# EAGLE board Arduino_DUE_V02b (EAGLE 6.4), part 1 of 2
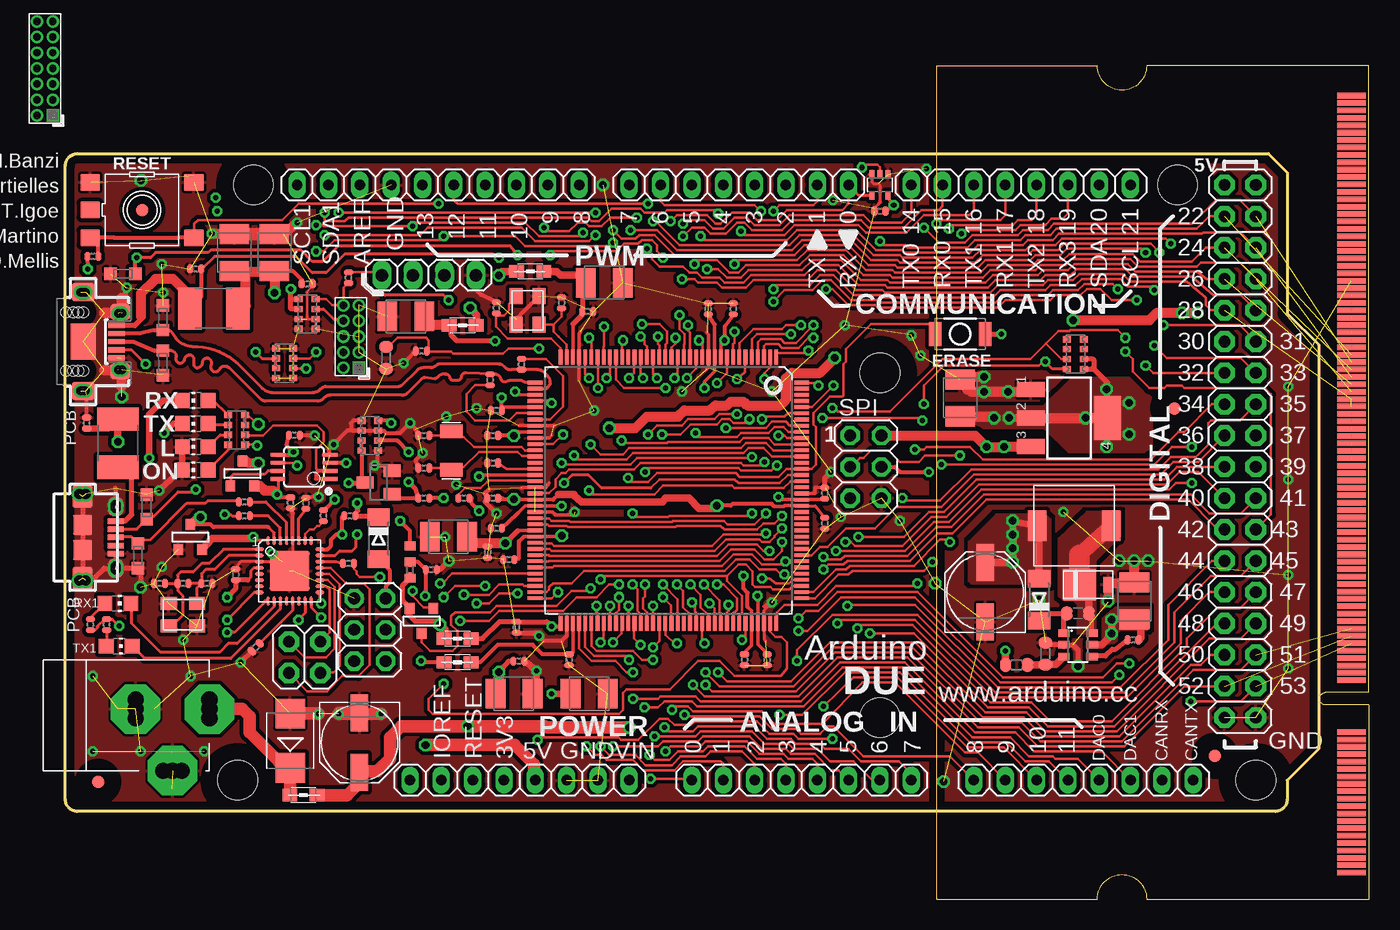
[diagram p3: board, top side]
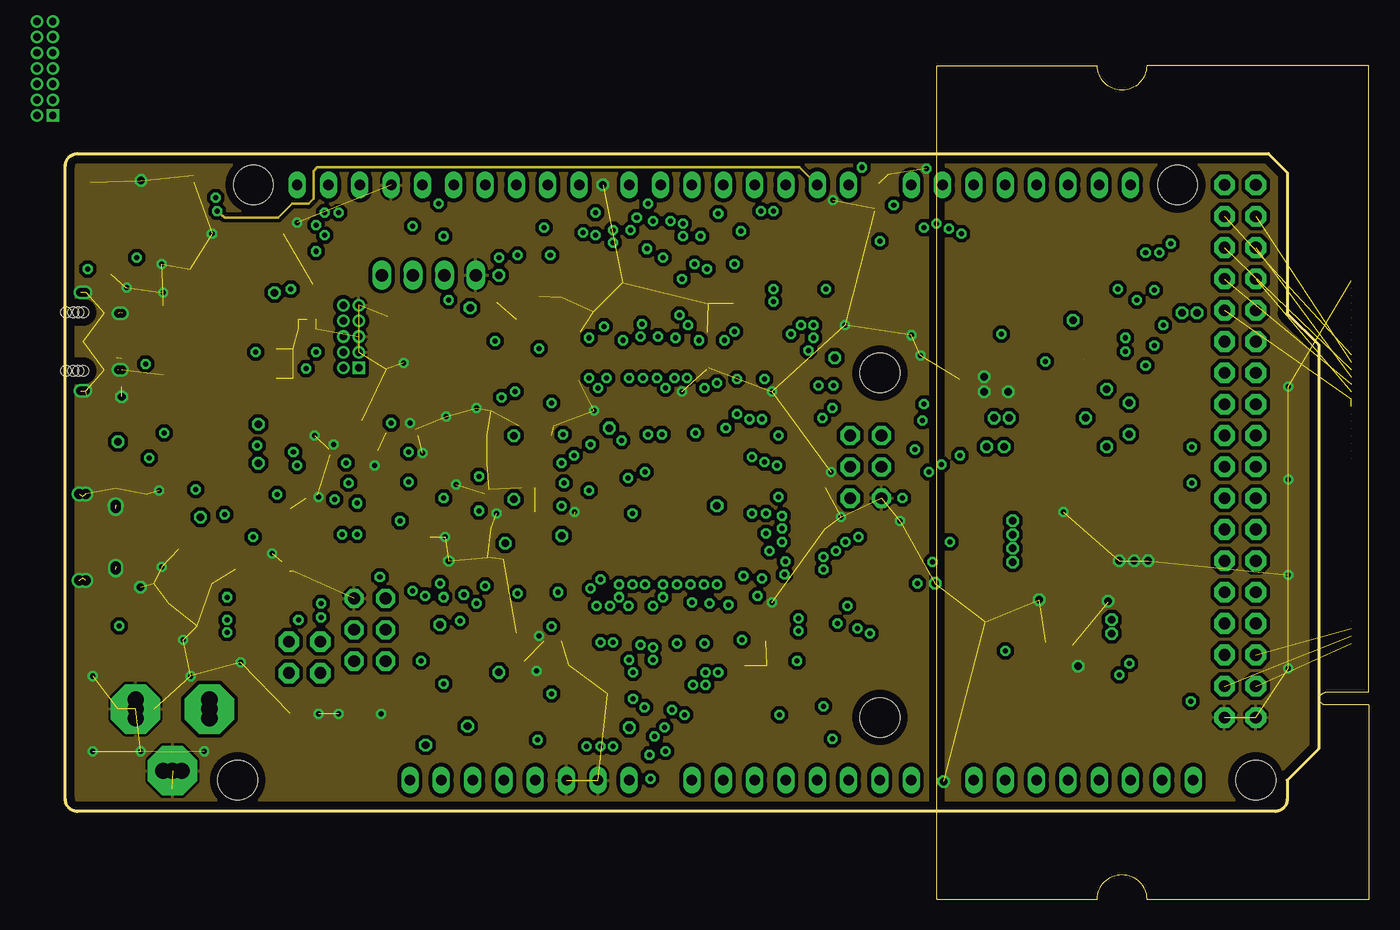
[diagram p4: board, inner layer Route2]
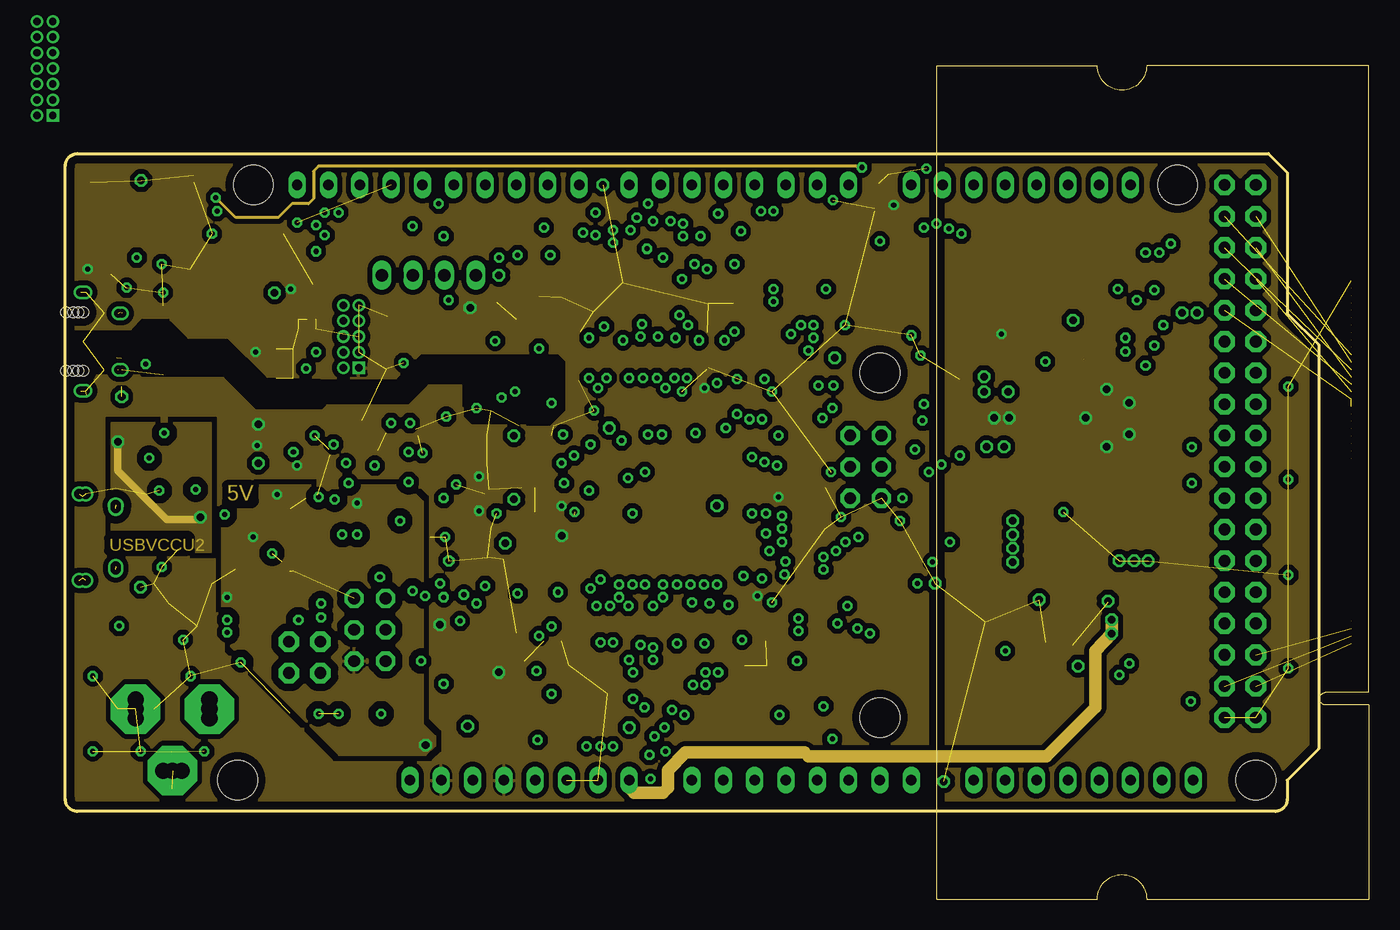
[diagram p5: board, inner layer Route15]
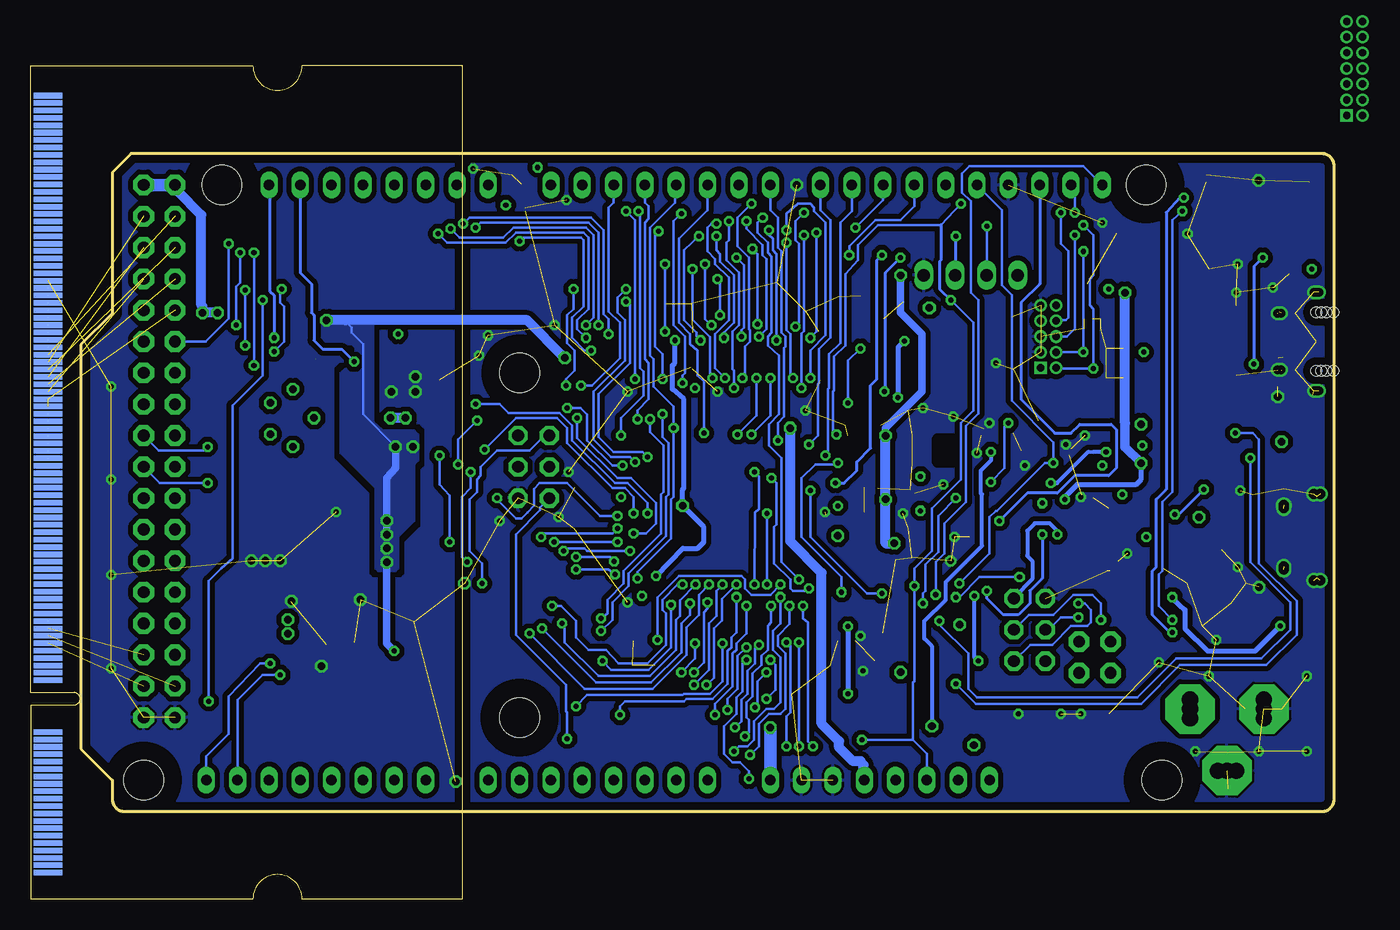
[diagram p6: board, bottom side, seen from below]

Size 101.6 x 53.34 mm. Coordinates in mm from the lower left corner, seen from the top.
Outline: 97.54,53.34 99.06,51.82 99.06,40.39 101.6,37.85 101.6,5.08 99.06,2.54 99.06,1 arc-90 98.06,0 1,0 arc-90 0,1 0,52.34 arc-90 1,53.34 97.54,53.34
Copper layers (1*2*15*16): Top 0.035mm / dielectric 0.2mm / Route2 0.035mm / dielectric 1mm / Route15 0.035mm / dielectric 0.2mm / Bottom 0.035mm
Design rules "default": minimum track width 8mil, minimum drill 16mil, track to track 8mil, track to pad 8mil, pad to pad 6mil, via to via 8mil, smd to smd 6mil, copper to edge 25mil, drill to drill 12mil, minimum pad ring 8mil, minimum via ring 8mil, stop-mask expansion 2mil, vias tented up to drill 25mil, thermal gap 8mil
Net classes: 0 default: width 0.203 mm, drill 0.305 mm, clearance 0.203 mm; 1 USB: drill 0.406 mm, clearance 0.203 mm to class 0, clearance 0.406 mm; 2 gnd: width 0.305 mm, drill 0.406 mm, clearance 0.203 mm to class 0, clearance 0.203 mm; 3 usbvcc: width 0.61 mm, drill 0.508 mm, clearance 0.203 mm to class 0, clearance 0.254 mm
Holes 3.2 mm at 96.52,2.54 15.24,50.8 90.17,50.8 13.97,2.54 66.04,35.56 66.04,7.62
tRestrict: area 63.5,5.1 to 68.6,10.2; area 12.7,48.3 to 17.8,53.3; area 63.5,33 to 68.6,38.1; area 87.6,48.3 to 92.7,53.3; area 94,0 to 99.1,5.1; area 11.4,0 to 16.5,5.1
bRestrict: area 63.5,5.1 to 68.6,10.2; area 12.7,48.3 to 17.8,53.3; area 63.5,33 to 68.6,38.1; area 87.6,48.3 to 92.7,53.3; area 94,0 to 99.1,5.1; area 11.4,0 to 16.5,5.1

## Footprints (pad centres in the part's own frame; a part is rotated, then mirrored left to right if it is on the bottom)
1X08 = drill 0.85 pad 1.422 long: 1 -8.89,0; 2 -6.35,0; 3 -3.81,0; 4 -1.27,0; 5 1.27,0; 6 3.81,0; 7 6.35,0; 8 8.89,0
J0402 = smd 0.7 x 0.9: 1 -0.65,0; 2 0.65,0; 3 1.95,0
SMC_B = smd 1.6 x 2.4: + -1.5,0; - 1.5,0
C0402 = smd 0.508 x 0.762: 1 -0.445,0; 2 0.445,0
C0603-ROUND = smd 0.898 x 1.1: 1 -0.889,0; 2 0.889,0
SMB = smd 2.4 x 2.4: A 2.2,0; C -2.2,0
MINIMELF = smd 1.4 x 1.8: A 1.7,0; C -1.7,0
DO220AAL = smd 2.667 x 2.54: P$1 -0.7,0 | smd 0.762 x 1.27: P$2 1.65,0
1X04 = drill 1.016 long: 1 -3.81,0; 2 -1.27,0; 3 1.27,0; 4 3.81,0
SMD_157SW = smd 1.016 x 1.981: 1 -2.032,0; 2 2.032,0
L1812 = smd 1.9 x 3.4: 1 -1.95,0; 2 1.95,0
FIDUCIA-MOUNT = smd 1.016 x 1.016: P$1 0,0
MSOP08 = smd 0.3 x 1.2: 1 -0.976,-2.113; 2 -0.326,-2.113; 3 0.324,-2.113; 4 0.974,-2.113; 5 0.974,2.112; 6 0.324,2.112; 7 -0.326,2.112; 8 -0.976,2.112
SOT23-6 = smd 0.6 x 0.9: 1 -0.95,-1.15; 2 0,-1.15; 3 0.95,-1.15; 4 0.95,1.15; 5 0,1.15; 6 -0.95,1.15
SOT223 = smd 1.219 x 2.235: 1 -2.311,-3.099; 2 0,-3.099; 3 2.311,-3.099 | smd 3.6 x 2.2: 4 0,3.099
MLF32 = smd 0.7 x 0.28: 1 -2.45,1.75; 2 -2.45,1.25; 3 -2.45,0.75; 4 -2.45,0.25; 5 -2.45,-0.25; 6 -2.45,-0.75; 7 -2.45,-1.25; 8 -2.45,-1.75; 17 2.45,-1.75; 18 2.45,-1.25; 19 2.45,-0.75; 20 2.45,-0.25; 21 2.45,0.25; 22 2.45,0.75; 23 2.45,1.25; 24 2.45,1.75 | smd 0.28 x 0.7: 9 -1.75,-2.45; 10 -1.25,-2.45; 11 -0.75,-2.45; 12 -0.25,-2.45; 13 0.25,-2.45; 14 0.75,-2.45; 15 1.25,-2.45; 16 1.75,-2.45; 25 1.75,2.45; 26 1.25,2.45; 27 0.75,2.45; 28 0.25,2.45; 29 -0.25,2.45; 30 -0.75,2.45; 31 -1.25,2.45; 32 -1.75,2.45 | smd 3.254 x 3.254: 33 0,0
SC70-5 = smd 0.4 x 0.7: 1 -0.65,-0.85; 2 0,-0.85; 3 0.65,-0.85; 4 0.65,0.85; 5 -0.65,0.85
2X03 = drill 0.95 pad 1.55 octagon: 1 -2.54,-1.27; 2 -2.54,1.27; 3 0,-1.27; 4 0,1.27; 5 2.54,-1.27; 6 2.54,1.27
CON2_USB_MICRO_B_AT = smd 0.406 x 1.346: P1 -1.321,2.692; P2 -0.66,2.692; P3 0,2.692; P4 0.66,2.692; P5 1.321,2.692 | drill 0.8 pad 1.27: P$1 -2.616,2.692 | drill 0.8 pad 1.245: P$2 -2.362,2.692; P$7 2.362,2.692; P$8 2.616,2.692 | drill 0.8 pad 1.143: P$3 -3.505,-0.254; P$4 -3.505,0.254; P$5 3.505,0.254; P$6 3.505,-0.254 | smd 1.778 x 1.651: S1 -3.302,0; S2 3.302,0 | smd 1.524 x 1.27: S3 -2.489,2.692; S4 2.489,2.692 | smd 1.626 x 1.524: S5 -1.016,0; S6 1.016,0
2X02 = drill 0.95 pad 1.676 octagon: 1 -1.27,-1.27; 2 -1.27,1.27; 3 1.27,-1.27; 4 1.27,1.27
R0402 = smd 0.508 x 0.762: 1 -0.445,0; 2 0.445,0
PINHEAD_2X05_127 = drill 0.6 pad 1.016 square: 1 -0.635,2.54 | drill 0.6 pad 1.016: 2 0.635,2.54; 3 -0.635,1.27; 4 0.635,1.27; 5 -0.635,0; 6 0.635,0; 7 -0.635,-1.27; 8 0.635,-1.27; 9 -0.635,-2.54; 10 0.635,-2.54
CHIP-LED0805 = smd 1.2 x 1.2: A 0,-1.05; C 0,1.05
0805 = smd 1.2 x 1: 1 -1.1,0; 2 1.1,0
SRR0604 = smd 1.5 x 2.5: P$1 3,0; P$2 -3,0
PINHEAD_2X07_127 = drill 0.6 pad 1.016 square: 1 -0.635,3.81 | drill 0.6 pad 1.016: 2 0.635,3.81; 3 -0.635,2.54; 4 0.635,2.54; 5 -0.635,1.27; 6 0.635,1.27; 7 -0.635,0; 8 0.635,0; 9 -0.635,-1.27; 10 0.635,-1.27; 11 -0.635,-2.54; 12 0.635,-2.54; 13 -0.635,-3.81; 14 0.635,-3.81
PANASONIC_D = smd 3 x 1.4: + 2.4,0; - -2.4,0
1X10 = drill 0.85 pad 1.422 long: 1 -11.43,0; 2 -8.89,0; 3 -6.35,0; 4 -3.81,0; 5 -1.27,0; 6 1.27,0; 7 3.81,0; 8 6.35,0; 9 8.89,0; 10 11.43,0
SOT23 = smd 1 x 1.4: 1 -0.95,-1.1; 2 0.95,-1.1; 3 0,1.1
R0603-ROUND = smd 0.898 x 1.1: 1 -0.889,0; 2 0.889,0
TS42 = smd 1.6 x 1.4: 1 -4.2,2.25; 2 4.2,2.25; 3 -4.2,-2.25; 4 4.2,-2.25; 5 -4.2,0
CAT16 = smd 0.5 x 0.65: 1 -1.2,-0.675; 2 -0.4,-0.675; 3 0.4,-0.675; 4 1.2,-0.675; 5 1.2,0.675; 6 0.4,0.675; 7 -0.4,0.675; 8 -1.2,0.675
CAY16 = smd 0.5 x 0.65: 1 -1.2,-0.675; 2 -0.4,-0.675; 3 0.4,-0.675; 4 1.2,-0.675; 5 1.2,0.675; 6 0.4,0.675; 7 -0.4,0.675; 8 -1.2,0.675
SODIMM_BOARD_SMALLER-67.6X35 = smd 0.45 x 2.3: 1 2.15,1.4; 3 2.75,1.4; 5 3.35,1.4; 7 3.95,1.4; 9 4.55,1.4; 11 5.15,1.4; 13 5.75,1.4; 15 6.35,1.4; 17 6.95,1.4; 19 7.55,1.4; 21 8.15,1.4; 23 8.75,1.4; 25 9.35,1.4; 27 9.95,1.4; 29 10.55,1.4; 31 11.15,1.4; 33 11.75,1.4; 35 12.35,1.4; 37 12.95,1.4; 39 13.55,1.4; 41 17.75,1.4; 43 18.35,1.4; 45 18.95,1.4; 47 19.55,1.4; 49 20.15,1.4; 51 20.75,1.4; 53 21.35,1.4; 55 21.95,1.4; 57 22.55,1.4; 59 23.15,1.4; 61 23.75,1.4; 63 24.35,1.4; 65 24.95,1.4; 67 25.55,1.4; 69 26.15,1.4; 71 26.75,1.4; 73 27.35,1.4; 75 27.95,1.4; 77 28.55,1.4; 79 29.15,1.4; 81 29.75,1.4; 83 30.35,1.4; 85 30.95,1.4; 87 31.55,1.4; 89 32.15,1.4; 91 32.75,1.4; 93 33.35,1.4; 95 33.95,1.4; 97 34.55,1.4; 99 35.15,1.4; 101 35.75,1.4; 103 36.35,1.4; 105 36.95,1.4; 107 37.55,1.4; 109 38.15,1.4; 111 38.75,1.4; 113 39.35,1.4; 115 39.95,1.4; 117 40.55,1.4; 119 41.15,1.4; 121 41.75,1.4; 123 42.35,1.4; 125 42.95,1.4; 127 43.55,1.4; 129 44.15,1.4; 131 44.75,1.4; 133 45.35,1.4; 135 45.95,1.4; 137 46.55,1.4; 139 47.15,1.4; 141 47.75,1.4; 143 48.35,1.4; 145 48.95,1.4; 147 49.55,1.4; 149 50.15,1.4; 151 50.75,1.4; 153 51.35,1.4; 155 51.95,1.4; 157 52.55,1.4; 159 53.15,1.4; 161 53.75,1.4; 163 54.35,1.4; 165 54.95,1.4; 167 55.55,1.4; 169 56.15,1.4; 171 56.75,1.4; 173 57.35,1.4; 175 57.95,1.4; 177 58.55,1.4; 179 59.15,1.4; 181 59.75,1.4; 183 60.35,1.4; 185 60.95,1.4; 187 61.55,1.4; 189 62.15,1.4; 191 62.75,1.4; 193 63.35,1.4; 195 63.95,1.4; 197 64.55,1.4; 199 65.15,1.4 | smd 0.45 x 2.3 bottom: 2 2.15,1.4; 4 2.75,1.4; 6 3.35,1.4; 8 3.95,1.4; 10 4.55,1.4; 12 5.15,1.4; 14 5.75,1.4; 16 6.35,1.4; 18 6.95,1.4; 20 7.55,1.4; 22 8.15,1.4; 24 8.75,1.4; 26 9.35,1.4; 28 9.95,1.4; 30 10.55,1.4; 32 11.15,1.4; 34 11.75,1.4; 36 12.35,1.4; 38 12.95,1.4; 40 13.55,1.4; 42 17.75,1.4; 44 18.35,1.4; 46 18.95,1.4; 48 19.55,1.4; 50 20.15,1.4; 52 20.75,1.4; 54 21.35,1.4; 56 21.95,1.4; 58 22.55,1.4; 60 23.15,1.4; 62 23.75,1.4; 64 24.35,1.4; 66 24.95,1.4; 68 25.55,1.4; 70 26.15,1.4; 72 26.75,1.4; 74 27.35,1.4; 76 27.95,1.4; 78 28.55,1.4; 80 29.15,1.4; 82 29.75,1.4; 84 30.35,1.4; 86 30.95,1.4; 88 31.55,1.4; 90 32.15,1.4; 92 32.75,1.4; 94 33.35,1.4; 96 33.95,1.4; 98 34.55,1.4; 100 35.15,1.4; 102 35.75,1.4; 104 36.35,1.4; 106 36.95,1.4; 108 37.55,1.4; 110 38.15,1.4; 112 38.75,1.4; 114 39.35,1.4; 116 39.95,1.4; 118 40.55,1.4; 120 41.15,1.4; 122 41.75,1.4; 124 42.35,1.4; 126 42.95,1.4; 128 43.55,1.4; 130 44.15,1.4; 132 44.75,1.4; 134 45.35,1.4; 136 45.95,1.4; 138 46.55,1.4; 140 47.15,1.4; 142 47.75,1.4; 144 48.35,1.4; 146 48.95,1.4; 148 49.55,1.4; 150 50.15,1.4; 152 50.75,1.4; 154 51.35,1.4; 156 51.95,1.4; 158 52.55,1.4; 160 53.15,1.4; 162 53.75,1.4; 164 54.35,1.4; 166 54.95,1.4; 168 55.55,1.4; 170 56.15,1.4; 172 56.75,1.4; 174 57.35,1.4; 176 57.95,1.4; 178 58.55,1.4; 180 59.15,1.4; 182 59.75,1.4; 184 60.35,1.4; 186 60.95,1.4; 188 61.55,1.4; 190 62.15,1.4; 192 62.75,1.4; 194 63.35,1.4; 196 63.95,1.4; 198 64.55,1.4; 200 65.15,1.4
SOT-23 = smd 0.787 x 0.889: 1 0.025,-1.016; 2 -0.94,1.016; 3 0.991,1.016
LQFP144 = smd 0.3 x 1.2: 1 -8.75,-10.8; 2 -8.25,-10.8; 3 -7.75,-10.8; 4 -7.25,-10.8; 5 -6.75,-10.8; 6 -6.25,-10.8; 7 -5.75,-10.8; 8 -5.25,-10.8; 9 -4.75,-10.8; 10 -4.25,-10.8; 11 -3.75,-10.8; 12 -3.25,-10.8; 13 -2.75,-10.8; 14 -2.25,-10.8; 15 -1.75,-10.8; 16 -1.25,-10.8; 17 -0.75,-10.8; 18 -0.25,-10.8; 19 0.25,-10.8; 20 0.75,-10.8; 21 1.25,-10.8; 22 1.75,-10.8; 23 2.25,-10.8; 24 2.75,-10.8; 25 3.25,-10.8; 26 3.75,-10.8; 27 4.25,-10.8; 28 4.75,-10.8; 29 5.25,-10.8; 30 5.75,-10.8; 31 6.25,-10.8; 32 6.75,-10.8; 33 7.25,-10.8; 34 7.75,-10.8; 35 8.25,-10.8; 36 8.75,-10.8; 73 8.75,10.8; 74 8.25,10.8; 75 7.75,10.8; 76 7.25,10.8; 77 6.75,10.8; 78 6.25,10.8; 79 5.75,10.8; 80 5.25,10.8; 81 4.75,10.8; 82 4.25,10.8; 83 3.75,10.8; 84 3.25,10.8; 85 2.75,10.8; 86 2.25,10.8; 87 1.75,10.8; 88 1.25,10.8; 89 0.75,10.8; 90 0.25,10.8; 91 -0.25,10.8; 92 -0.75,10.8; 93 -1.25,10.8; 94 -1.75,10.8; 95 -2.25,10.8; 96 -2.75,10.8; 97 -3.25,10.8; 98 -3.75,10.8; 99 -4.25,10.8; 100 -4.75,10.8; 101 -5.25,10.8; 102 -5.75,10.8; 103 -6.25,10.8; 104 -6.75,10.8; 105 -7.25,10.8; 106 -7.75,10.8; 107 -8.25,10.8; 108 -8.75,10.8 | smd 1.2 x 0.3: 37 10.8,-8.75; 38 10.8,-8.25; 39 10.8,-7.75; 40 10.8,-7.25; 41 10.8,-6.75; 42 10.8,-6.25; 43 10.8,-5.75; 44 10.8,-5.25; 45 10.8,-4.75; 46 10.8,-4.25; 47 10.8,-3.75; 48 10.8,-3.25; 49 10.8,-2.75; 50 10.8,-2.25; 51 10.8,-1.75; 52 10.8,-1.25; 53 10.8,-0.75; 54 10.8,-0.25; 55 10.8,0.25; 56 10.8,0.75; 57 10.8,1.25; 58 10.8,1.75; 59 10.8,2.25; 60 10.8,2.75; 61 10.8,3.25; 62 10.8,3.75; 63 10.8,4.25; 64 10.8,4.75; 65 10.8,5.25; 66 10.8,5.75; 67 10.8,6.25; 68 10.8,6.75; 69 10.8,7.25; 70 10.8,7.75; 71 10.8,8.25; 72 10.8,8.75; 109 -10.8,8.75; 110 -10.8,8.25; 111 -10.8,7.75; 112 -10.8,7.25; 113 -10.8,6.75; 114 -10.8,6.25; 115 -10.8,5.75; 116 -10.8,5.25; 117 -10.8,4.75; 118 -10.8,4.25; 119 -10.8,3.75; 120 -10.8,3.25; 121 -10.8,2.75; 122 -10.8,2.25; 123 -10.8,1.75; 124 -10.8,1.25; 125 -10.8,0.75; 126 -10.8,0.25; 127 -10.8,-0.25; 128 -10.8,-0.75; 129 -10.8,-1.25; 130 -10.8,-1.75; 131 -10.8,-2.25; 132 -10.8,-2.75; 133 -10.8,-3.25; 134 -10.8,-3.75; 135 -10.8,-4.25; 136 -10.8,-4.75; 137 -10.8,-5.25; 138 -10.8,-5.75; 139 -10.8,-6.25; 140 -10.8,-6.75; 141 -10.8,-7.25; 142 -10.8,-7.75; 143 -10.8,-8.25; 144 -10.8,-8.75
MCR-AB1-S-RA-SMT = smd 0.4 x 1.35: 1 -1.3,2.7; 2 -0.65,2.7; 3 0,2.7; 4 0.65,2.7; 5 1.3,2.7 | drill 0.7: P$1 -4,0.2; P$3 -4,0; P$4 -4,-0.2; P$5 4,0.2; P$6 4,0; P$7 4,-0.2 | smd 2.9 x 2: P$2 0,0 | drill 0.7 pad 1.1: P$8 -2.3,3.15; P$9 -2.3,2.85; P$10 2.3,3.15; P$11 2.3,2.85 | smd 1.3 x 1.6: S1 -2.4,3; S2 2.4,3 | smd 1.5 x 1.8: S3 -4,0; S4 4,0 | hole 0.85: -2.375,0; 2.375,0; -2.375,-1.4; 2.375,-1.4; -2.375,-0.4; 2.375,-0.4; 2.375,-0.8; -2.375,-0.8
POWERSUPPLY_DC-21MM = drill 1.3 pad 4 octagon: 1 -5.08,-3.353; 2 -0.076,-6.35; 3 -0.076,-0.356 | drill 1.3: 4 -5.08,-4.115; 5 -5.08,-2.591; 6 -0.838,-0.356; 7 0.686,-0.356; 8 -0.838,-6.35; 9 0.686,-6.35
2X18 = drill 0.95 pad 1.676 octagon: 1 -21.59,-1.27; 2 -21.59,1.27; 3 -19.05,-1.27; 4 -19.05,1.27; 5 -16.51,-1.27; 6 -16.51,1.27; 7 -13.97,-1.27; 8 -13.97,1.27; 9 -11.43,-1.27; 10 -11.43,1.27; 11 -8.89,-1.27; 12 -8.89,1.27; 13 -6.35,-1.27; 14 -6.35,1.27; 15 -3.81,-1.27; 16 -3.81,1.27; 17 -1.27,-1.27; 18 -1.27,1.27; 19 1.27,-1.27; 20 1.27,1.27; 21 3.81,-1.27; 22 3.81,1.27; 23 6.35,-1.27; 24 6.35,1.27; 25 8.89,-1.27; 26 8.89,1.27; 27 11.43,-1.27; 28 11.43,1.27; 29 13.97,-1.27; 30 13.97,1.27; 31 16.51,-1.27; 32 16.51,1.27; 33 19.05,-1.27; 34 19.05,1.27; 35 21.59,-1.27; 36 21.59,1.27
CRYSTAL-3.2-2.5 = smd 1.3 x 1.05: 1 -1.15,-0.925; 2 1.15,-0.925; 3 1.15,0.925; 4 -1.15,0.925
RESONATOR_EPSON_FC_145 = smd 1.1 x 1.8: P$1 -1.55,0; P$2 1.55,0
CT/CN0603 = smd 1 x 1: 1 -1,0; 2 1,0

## Placement (x,y rotation side)
ADCH  8x1F-H8.5  [1X08]  82.55,2.54 0 top
ADCL  8x1F-H8.5  [1X08]  59.69,2.54 0 top
BR1  NM  [J0402]  27.94,20.88 270 top
C1  10u  [SMC_B]  36.37,9.55 0 top
C2  10u  [SMC_B]  27.61,40.13 180 top
C3  10u  [SMC_B]  42.47,9.55 0 top
C4  100n  [C0402]  35.97,20.42 0 top
C5  100n  [C0402]  52.12,40.74 270 top
C6  100n  [C0402]  34.95,22.96 0 top
C7  100n  [C0402]  56.9,12.29 90 top
C8  100n  [C0402]  61.57,25.81 270 top
C9  100n  [C0402]  34.95,32.51 0 top
C10  100n  [C0402]  36.58,14.94 90 top
C11  10u  [SMC_B]  31.06,22.28 180 top
C12  100n  [C0402]  34.24,21.03 90 top
C13  100n  [C0402]  54.15,40.74 270 top
C14  100n  [C0402]  34.65,30.48 0 top
C15  100n  [C0402]  34.65,25.4 0 top
C16  100n  [C0402]  55.07,12.29 90 top
C17  100n  [C0402]  61.57,23.37 90 top
C18  100n  [C0402]  36.78,12.19 180 top
C19  100n  [C0402]  40.84,12.29 90 top
C20  10n  [C0402]  2.24,45.01 180 top
C21  22p  [C0402]  40.23,41.25 90 top
C22  22p  [C0402]  34.95,40.84 90 top
C23  22pF_NM  [C0402]  29.06,27.84 180 top
C24  22pF_NM  [C0402]  29.06,30.48 180 top
C25  22p  [C0402]  28.85,37.34 180 top
C26  10n  [C0402]  10.57,43.99 180 top
C27  10u  [SMC_B]  16.97,45.31 90 top
C28  100n  [C0402]  1.73,31.5 90 top
C29  10u  [SMC_B]  72.54,33.53 90 top
C30  100n  [C0402]  18.26,25.02 90 top
C31  100n  [C0402]  18.57,30.51 180 top
C32  100n  [C0402]  42.37,40.54 180 top
C33  10u  [SMC_B]  43.69,42.88 0 top
C34  100n  [C0402]  29.67,19.61 180 top
C35  10u  [SMC_B]  13.72,45.31 90 top
C36  100n  [C0402]  13.82,19.2 90 top
C37  100n  [C0402]  66.04,48.67 180 top
C38  1u  [C0402]  19.51,24.99 90 top
C39  22p  [C0402]  7.62,18.49 180 top
C40  22p  [C0402]  11.48,18.49 0 top
C41  10u  [SMC_B]  86.66,17.07 90 top
C42  10n  [C0603-ROUND]  82.09,16.05 0 top
COMMUNICATION  8x1F-H8.5  [1X08]  77.47,50.8 0 top
D1  M7  [SMB]  18.24,5.74 90 top
D2  CD1206-S01575  [MINIMELF]  25.4,22.15 270 top
D3  CD1206-S01575  [MINIMELF]  78.94,17.17 90 top
D4  SS1P3L  [DO220AAL]  82.91,18.39 0 top
DEBUG  STRIP 4x1V M  [1X04]  29.46,43.48 180 top
ERASE  [SMD_157SW]  72.54,38.71 180 top
F1  MF-MSMF050-2 500mA  [L1812]  12.04,40.79 180 top
F2  MF-MSMF050-2 500mA  [L1812]  4.27,29.87 270 top
FID1  FIDUCIALMOUNT  [FIDUCIA-MOUNT]  89.92,32.68 0 top
FID2  FIDUCIALMOUNT  [FIDUCIA-MOUNT]  93.19,4.5 0 top
FID3  FIDUCIALMOUNT  [FIDUCIA-MOUNT]  6.22,48.77 0 top
FID4  FIDUCIALMOUNT  [FIDUCIA-MOUNT]  2.67,2.41 0 top
IC1  LMV358IDGKR  [MSOP08]  19.35,27.94 90 top
IC2  LM2734Y  [SOT23-6]  82.09,13.51 270 top
IC4  NCP1117ST33T3G -3V3  [SOT223]  81.38,31.9 270 top
IC6  ATMEGA16U2-MU  [MLF32]  18.19,19.51 0 top
IC10  74LVC1G125DCK  [SC70-5]  66.04,50.8 180 top
ICSP1  3x2M  [2X03]  24.69,14.73 90 top
J3  USB-MICRO B  [CON2_USB_MICRO_B_AT]  1.4,22.23 270 top
JP5  2x2M - NM  [2X02]  19.41,12.5 180 top
JR1  0R  [R0402]  27.94,19.61 90 top
JTAG  [PINHEAD_2X05_127]  23.16,38.51 180 top
L  YELLOW  [CHIP-LED0805]  10.54,29.57 90 top
L1  MH2029-300Y  [0805]  31.8,14.02 0 top
L2  MH2029-300Y  [0805]  32.21,39.42 180 top
L3  MH2029-300Y  [0805]  31.8,12.09 0 top
L4  10u SRR0604-100ML  [SRR0604]  81.79,23.16 0 top
L5  MH2029-300Y  [0805]  37.69,43.79 0 top
L6  MH2029-300Y  [0805]  19.3,1.32 180 top
MACB  [PINHEAD_2X07_127]  -1.65,60.25 180 top  (outside the outline)
ON  GREEN  [CHIP-LED0805]  10.54,27.69 90 top
PC1  47u  [PANASONIC_D]  23.85,5.59 270 top
PC2  47u  [PANASONIC_D]  74.57,17.78 90 top
POWER  8x1F-H8.5  [1X08]  36.83,2.54 0 top
PWMH  10x1F-H8.5  [1X10]  30.23,50.8 180 top
PWML  8x1F-H8.5  [1X08]  54.61,50.8 180 top
Q2  BC847BSMD  [SOT23]  25.4,26.67 90 top
R1  0R  [R0402]  22.96,43.28 90 top
R2  10K  [R0402]  19.61,42.77 180 top
R3  1K  [R0402]  29.06,25.4 180 top
R4  100K  [R0402]  32.31,25.4 0 top
R5  39R 1%  [R0402]  36.98,36.27 90 top
R6  39R 1%  [R0402]  34.44,35 270 top
R7  6k8 1%  [R0603-ROUND]  26.01,36.78 90 top
R8  0R_NM  [R0402]  34.65,28.24 0 top
R9  1M_NM  [R0402]  9.55,18.49 0 top
R10  10k  [R0402]  86.56,13.92 180 top
R11  10K  [R0603-ROUND]  79.45,12.8 90 top
R12  52K3  [R0603-ROUND]  77.11,11.89 0 top
R13  10K  [R0402]  23.06,23.98 0 top
R14  1K  [R0402]  3.35,15.14 270 top
R15  1K  [R0402]  2.03,15.14 90 top
R18  10K  [R0402]  15.44,13.31 225 top
R19  22R  [R0402]  14.53,23.98 180 top
R20  22R  [R0402]  14.53,25.1 180 top
R21  1K  [R0402]  20.93,23.98 90 top
R23  10K  [R0402]  22.96,20.12 0 top
RESET  TS42  [TS42]  6.22,48.77 0 top
RN1  100K  [CAT16]  19.61,40.34 90 top
RN2  100K  [CAT16]  17.78,36.35 270 top
RN3  1k  [CAY16]  13.89,30.94 270 top
RN4  100K  [CAT16]  24.69,30.48 270 top
RN5  1K5  [CAT16]  81.89,37.08 90 top
RX  YELLOW  [CHIP-LED0805]  10.54,33.32 90 top
RX1  YELLOW  [CHIP-LED0805]  4.27,16.87 270 top
SODIMM1  [SODIMM_BOARD_SMALLER-67.6X35]  105.66,-7.11 90 top
SPI  3x2M  [2X03]  64.9,27.94 270 top
T1  FDN340P  [SOT-23]  14.38,27.41 180 top
T2  FDN340P  [SOT-23]  10.16,22.25 180 top
T3  FDN340P  [SOT-23]  28.85,15.44 0 top
TX  YELLOW  [CHIP-LED0805]  10.54,31.45 90 top
TX1  YELLOW  [CHIP-LED0805]  4.37,13.41 270 top
U1  ATSAM3X8EA-AU  [LQFP144]  48.9,26.04 180 top
USB1  MICRO-USB-AB1  [MCR-AB1-S-RA-SMT]  1.45,38.1 270 top
X2  POWERSUPPLY_DC21MMX  [POWERSUPPLY_DC-21MM]  5.33,8.38 90 top
XIO  18x2F-H8.5  [2X18]  95.25,29.21 270 top
Y1  12MHz KX-7 20pF  [CRYSTAL-3.2-2.5]  37.47,40.64 270 top
Y2  32.768Khz  [RESONATOR_EPSON_FC_145]  31.29,29.26 90 top
Y4  12MHz KX-7 20pF  [CRYSTAL-3.2-2.5]  9.55,15.95 0 top
Z1  CG0603MLC-05E  [CT/CN0603]  7.92,36.37 270 top
Z2  CG0603MLC-05E  [CT/CN0603]  7.92,40.03 90 top
Z3  CG0603MLC-05E  [CT/CN0603]  6.6,24.69 270 top
Z4  CG0603MLC-05E  [CT/CN0603]  5.89,20.73 90 top
Z5  CG0603MLC-05E  [CT/CN0603]  4.67,43.59 0 top

## Tracks (layer width: path | path; a pad name or v marks a point on that pad's centre or on a via)
8PB4
  Top 0.203: IC6.18 21.16,18.26 21.44,17.98 21.44,14.53 JP5.1
8PB5
  Top 0.203: IC6.19 21.27,18.76 21.84,18.19 21.84,13.21 21.13,12.5 19.41,12.5 JP5.3
8PB6
  Top 0.203: IC6.20 21.38,19.26 22.25,18.39 22.25,11.79 21.74,11.28 20.73,11.28 JP5.2
8PB7
  Top 0.203: IC6.21 21.49,19.76 22.76,18.49 24.18,18.49 24.69,17.98 24.69,11.89 23.77,10.97 22.45,10.97 21.23,9.75 19.61,9.75 JP5.4
16U2-TX  (via drill 0.41)
  Top 0.203: IC10.2 66.04,52.22 65.84,52.43 64.77,52.43 v64.57,52.22
  Top 0.254: IC6.9 16.14,17.06 16.14,16.96 13.72,14.53 v13.11,14.53
  Route15 0.254: v64.57,52.22 64.21,52.22 64.11,52.32 20.52,52.32 20.12,51.92 20.12,49.68 19.71,49.28 18.39,49.28 17.27,48.16 13.82,48.16 v12.19,49.78
  Bottom 0.254: v12.19,49.78 12.5,49.78 13.61,48.56 13.61,26.11 14.43,25.3 14.43,19.81 14.73,19.51 14.73,15.95 13.31,14.53 v13.11,14.53
+3V3  (via drill 0.41, 0.61)  (1 unrouted)
  Top 0.203: C1.+ 34.95,9.55 | 32.72,25.4 R4.2 | 38,24.79 U1.57 38.19,24.78 | 40.17,22.29 v40.23,22.35 | 52.64,36.88 U1.11 | 32.72,25.39 R4.2 | 32.94,25.4 32.82,25.43 32.72,25.4 | R4.2 arc60 32.72,25.4 | L2.1 33.36,39.45 33.33,39.62 | 35.97,12.19 C18.2 | 38.01,22.29 38.05,22.28 U1.62 | 17.09,36.73 RN2.2 | 61.57,25.4 C8.2 | RN3.7 RN3.8 14.8,32.14 v15.65,31.39 | IC1.6 18.57,28.26 v18.8,28.04 | RN3.5 15.51,29.74 v15.54,29.67
  Top 0.254: v15.44,37.24 15.95,36.73 17.07,36.73 | 17.07,36.73 17.09,36.73 | RN2.3 17.04,35.95 17.07,36.12 17.07,36.73 | IC10.5 66.69,49.72 v67.16,49.17 66.65,48.67 C37.1
  Top 0.279: 38,24.79 37.27,24.78 36.68,24.18 | U1.52 33.71,27.29 33.6,27.18 v33.53,27.18 | U1.62 40.17,22.29 | v40.22,24.78 38.19,24.78 | v51.82,34.34 51.82,34.85 52.64,35.67 52.64,36.8 52.65,36.8 U1.11 | 52.64,36.88 52.64,39.5 | v56.13,17.48 56.15,17.23 U1.105 56.15,13.55 56.9,12.8 C7.2 | 61.57,25.4 61.48,25.29 U1.125 58.03,25.29 v57.81,25.5 | 37.17,22.29 38.01,22.29
  Top 0.305: v33.53,24.38 32.94,24.97 32.94,25.4 | 52.64,39.5 C5.2 | 37.17,22.29 36.78,21.89 36.78,20.52 C4.2 | C6.2 35.4,23 36.68,24.18 | C20.2 v1.83,43.99 | JR1.1 BR1.3
  Top 0.406: v35.15,11.28 35.97,12.19 | ERASE.1 v75.89,38.71 | 30.64,14.08 L1.1 | RN5.1 83.23,35.88 | 83.23,35.88 83.41,36.07 83.41,36.58 83.31,36.68 RN5.2 | 83.23,35.88 83.39,35.88 84.48,34.8 IC4.4 | RN1.6 18.29,40.73 18.29,41.55 | 18.29,41.55 18.32,41.55 RN1.5 | 18.29,41.55 v18.29,42.37 | v30.38,15.14 30.07,15.44 28.35,15.44 27.71,16.08 T3.2 27.71,16.69 27.33,17.17 27.33,18.32 BR1.3 | RN5.2
  Top 0.61: v32.82,40.84 33.33,40.23 33.33,39.62 | v76.5,31.9 IC4.2
  Top 0.813: 34.95,9.55 34.95,10.16 35.15,10.36 v35.15,11.28 | v30.38,15.14 30.68,14.73 30.68,14.02 L1.1 | IC4.2 IC4.4 | C29.+ 75.16,32.03 v75.29,31.9
  Bottom 0.813: v75.29,31.9 v76.5,31.9
  other vias: 84.43,34.24 82.7,31.9 86.26,33.12 86.26,30.58 84.43,29.57
  pour Top (isolate 0.406, no thermals): 71.42,31.19 71.42,32.82 79.25,32.82 79.25,32.82 81.58,35.15 86.46,35.15 88.09,33.53 88.09,29.67 87.48,29.16 81.58,29.06 81.38,29.06 79.35,31.09 74.07,31.09 73.96,31.19
  pour Route15 (isolate 0.406, rank 2): 101.63,53.31 101.42,-0.08 -0.25,-0.08 0,35.36 5.99,35.36 6.2,35.15 12.8,35.15 15.44,32.51 20.83,32.51 21.23,32.92 27.84,32.92 29.46,34.54 32.11,34.54 32.11,32.82 32.21,32.72 32.21,32 32.92,31.29 37.29,31.29 37.39,31.19 39.32,31.19 40.64,32.51 40.64,36.47 39.93,37.19 28.85,37.19 26.82,35.15 20.73,35.15 16.36,35.26 13.15,38.4 9.96,38.4 8.53,39.83 8.53,40.03 6.2,40.03 5.28,39.12 -0.1,39.12 -0.25,51.6 arc-90 1.43,53.21
+5V  (via drill 0.41, 0.61)
  Top 0.254: IC6.4 15.29,19.76 15.04,19.51 15.04,19 14.79,18.76 | IC6.32 15.23,21.96 v15.24,22.25 | v4.37,15.04 3.82,15.58 R14.1 3.19,15.58 2.64,15.04 2.64,14.94 2.4,14.69 R15.1 | IC1.8 17.24,25.78 v17.17,25.7
  Top 0.305: C30.2 17.41,25.46 v17.17,25.7
  Top 0.406: 25.27,23.98 R13.2 23.52,24.18 23.71,24.37 23.71,24.95 v23.67,24.99 | 25.27,23.98 D2.C | 25.27,23.98 25.3,23.98 | 14.79,18.76 C36.1 13.83,18.09 v13.11,17.37 | 15.14,22.15 v15.24,22.25
  Top 0.508: L4.P$2 77.01,23.47 76.81,23.27 v76.81,22.45
  Top 0.61: PC2.+ 76.77,20.18 v76.81,20.22 v76.81,21.34 v76.81,22.45 | R12.1 v76.2,13.01 | D3.A 78.94,23.31 L4.P$2 | T2.2 11.89,22.15 15.14,22.15
  Top 0.813: 38,2.64 POWER.5 | v81.69,39.83 87.88,39.83 88.49,40.44 v90.53,40.44 v91.75,40.44 | v44.09,31.09 46.23,31.09 47.14,32 49.68,32 50.19,32.51 52.27,32.51 52.73,32.92 53.65,32.92 53.95,33.22 54.97,33.22 55.27,32.92 57.96,32.92 58.42,33.38 58.42,35.1 58.88,35.56 61.16,35.56 v62.38,36.78 | v76.1,29.57 78.05,29.59 IC4.3 76.12,29.57 v74.68,29.57 73.76,30.48 SPI.2 | T1.2 15.77,26.39 16.15,26.01 16.87,26.01 v17.17,25.7
  Top 1.016: v29.21,5.38 36.42,5.38 38,3.81 38,2.64
  Bottom 0.203: 80.16,39.83 80.16,39.73 79.65,39.22 79.65,38.81 78.74,37.9 78.74,32.21 v76.1,29.57
  Bottom 0.406: v13.11,17.37 13.11,17.27 12.09,16.36 12.09,14.83 10.26,13.01 6.4,13.01 v4.37,15.04
  Bottom 0.61: 38.15,2.44 POWER.5 | v76.81,22.45 76.81,27.03 76.1,27.84 v76.1,29.57 | v76.2,13.01 76.81,13.61 v76.81,20.22
  Bottom 0.813: XIO.1 93.78,50.29 91.85,48.36 91.85,41.05 91.75,40.95 v91.75,40.44 v90.53,40.44 | 38.15,3.4 38.15,3.76 38.41,4.06 39.01,4.06 40.13,5.18 40.13,5.69 41.55,7.11 41.55,19.36 44.09,21.89 v44.09,31.09 | POWER.5 38.15,3.4 | 38.15,3.4 38.15,2.44 | 62.59,36.98 v62.38,36.78 65.43,39.83 80.16,39.83 v81.69,39.83
  Bottom 1.016: XIO.1 XIO.2
  other vias: 76.81,23.57
  pour Top (isolate 0.406, no thermals): 79.45,24.08 75.49,24.08 73.25,21.84 73.25,18.69 73.46,18.49 79.86,18.49 79.86,23.67
  pour Bottom (isolate 0.406): 74.27,30.58 74.27,28.45 74.57,28.14 74.57,23.57 75.9,22.25 75.9,19.71 76.1,19.51 77.52,19.51 77.72,19.71 77.72,26.21 80.57,29.06 80.57,35.56 79.35,36.78 79.35,37.59 79.65,37.9 81.58,37.9 82.3,38.61 82.3,40.13 77.93,40.03 77.93,31.6 77.11,30.89 74.57,30.89
  pour Route15 (isolate 0.61): 29.21,4.57 22.19,4.57 12.7,14.06 12.7,26.16 12.95,26.42 27.69,26.42 28.96,25.15 28.96,7.11 29.97,6.1 29.97,5.33
AD0  (via drill 0.41)
  Top 0.203: v47.65,12.29 46.74,12.29 46.02,13.01 43.08,13.01 42.67,13.41 42.67,15.04 U1.78 | ADCL.1 50.8,2.64 v47.45,2.64
  Bottom 0.203: v47.65,12.29 47.95,11.99 47.95,9.75 48.46,9.25 48.46,7.92 49.48,6.91 49.48,4.67 48.77,3.96 48.16,3.96 47.45,3.25 v47.45,2.64
AD1  (via drill 0.41)
  Top 0.203: U1.79 43.18,15.23 43.18,16.05 43.08,16.15 v43.08,16.66 | v42.27,5.28 42.98,4.57 43.48,4.57 43.89,4.17 46.02,4.17 46.84,3.35 49.38,3.35 50.09,4.06 53.14,4.06 53.34,3.86 ADCL.2
  Bottom 0.203: v43.08,16.66 43.08,15.65 42.67,15.34 42.67,5.69 v42.27,5.28
AD2  (via drill 0.41)
  Top 0.203: v43.38,13.72 43.64,13.92 U1.80 | ADCL.3 55.88,3.86 54.86,4.88 52.32,4.88 51.92,4.47 49.89,4.47 49.17,3.76 47.04,3.76 46.23,4.57 44.09,4.57 v43.38,5.28
  Bottom 0.203: v43.38,5.28 v43.38,13.72
AD3  (via drill 0.41)
  Top 0.203: U1.81 44.15,16.61 v44.15,16.66 | ADCL.4 58.42,3.86 58.01,4.27 56.08,4.27 55.07,5.28 52.12,5.28 51.71,4.88 49.68,4.88 48.97,4.17 47.75,4.17 v47.35,4.57
  Bottom 0.203: v44.15,16.66 44.15,15.19 45.11,14.22 45.11,13.41 44.5,12.8 44.5,8.33 44.91,7.92 45.82,7.92 46.63,7.11 46.63,5.28 v47.35,4.57
AD4  (via drill 0.41)
  Top 0.203: U1.82 44.65,16.09 44.91,16.36 v44.91,17.37 | 60.96,2.44 ADCL.5 60.96,3.86 60.55,4.27 58.62,4.27 58.22,4.67 56.29,4.67 55.27,5.69 51.92,5.69 51.51,5.28 49.07,5.28 v48.67,4.88
  Bottom 0.203: v44.91,17.37 44.91,15.24 45.52,14.63 45.52,13.11 44.91,12.5 44.91,8.84 45.41,8.33 46.02,8.33 47.04,7.32 47.04,5.79 47.55,5.28 48.26,5.28 v48.67,4.88
AD5  (via drill 0.41)
  Top 0.203: v44.4,13.72 45.11,14.43 45.11,15.04 U1.83 | v44.4,5.28 48.06,5.28 48.46,5.69 51.31,5.69 51.71,6.1 55.47,6.1 56.49,5.08 58.42,5.08 58.83,4.67 60.76,4.67 62.08,3.35 62.69,3.35 ADCL.6
  Bottom 0.203: v44.4,13.72 44.09,13.41 44.09,8.03 44.4,7.72 v44.4,5.28
AD6  (via drill 0.41)
  Top 0.203: U1.84 45.65,16.59 v45.64,16.66 | v47.75,6.1 51.1,6.1 51.51,6.5 55.68,6.5 56.69,5.49 58.62,5.49 59.03,5.08 60.96,5.08 61.98,4.06 63.91,4.06 65.43,2.54 ADCL.7
  Bottom 0.203: v47.75,6.1 47.45,6.4 47.45,7.42 47.65,7.62 47.65,8.84 47.14,9.35 47.14,11.18 46.43,11.89 46.43,12.6 45.92,13.11 45.92,15.04 45.64,15.32 v45.64,16.66
AD7  (via drill 0.41)
  Top 0.203: v46.63,13.51 46.58,13.56 46.13,14.02 46.13,15.04 U1.85 | ADCL.8 68.58,3.05 67.56,4.06 64.52,4.06 63.5,5.08 61.57,5.08 61.16,5.49 59.23,5.49 58.83,5.89 56.9,5.89 55.88,6.91 51.31,6.91 50.9,6.5 48.87,6.5 v48.56,6.81
  Bottom 0.203: v46.63,13.51 46.94,13.21 46.94,11.99 47.55,11.38 47.55,9.55 48.06,9.04 48.06,7.32 v48.56,6.81
AD8  (via drill 0.41)
  Top 0.203: U1.88 47.65,16.55 v47.65,16.66 | v50.19,7.82 50.29,7.72 56.29,7.72 57.3,6.71 59.23,6.71 59.64,6.3 61.16,6.3 61.77,6.91 62.28,6.91 64.72,4.47 71.73,4.47 ADCH.1
  Bottom 0.203: v47.65,16.66 47.65,14.43 48.46,13.61 48.46,13.11 48.77,12.8 48.77,10.16 50.19,8.74 v50.19,7.82
AD9  (via drill 0.41)
  Top 0.203: v49.17,8.23 49.48,8.53 50.49,8.53 50.9,8.13 56.49,8.13 57.51,7.11 61.37,7.11 64.62,10.46 67.26,10.46 72.95,4.78 73.97,4.78 ADCH.2 | U1.89 48.16,15.04 48.16,13.85 48.14,13.8 47.73,13.39 | 47.63,13.31 47.73,13.39 | 47.73,13.39 v47.65,13.31
  Bottom 0.203: v49.17,8.23 49.17,9.14 48.36,9.96 48.36,12.6 v47.65,13.31
AD10  (via drill 0.41)
  Top 0.203: v49.58,13.61 49.38,13.61 48.67,14.33 48.67,15.24 U1.90 | v61.47,8.53 63.91,10.87 67.46,10.87 73.15,5.18 76.1,5.18 ADCH.3
  Bottom 0.203: v49.58,13.61 49.58,10.57 50.6,9.55 52.73,9.55 52.83,9.45 60.55,9.45 v61.47,8.53
AD11(TXD3)  (via drill 0.41)
  Top 0.203: v57.91,7.82 59.74,7.82 63.2,11.28 67.67,11.28 73.36,5.59 76.3,5.59 77.83,4.06 79.76,4.06 ADCH.4 | U1.91 49.12,15.29 49.12,16.71 v48.46,17.37
  Bottom 0.203: v48.46,17.37 48.46,14.53 48.87,14.12 48.87,13.31 49.17,13.01 49.17,10.36 50.39,9.14 52.53,9.14 52.73,8.94 57.51,8.94 57.91,8.53 v57.91,7.82
AD14(RXD3)  (via drill 0.41)  (2 unrouted)
  Top 0.203: U1.92 49.65,17.21 v48.46,18.39 | v50.9,10.26 51.82,9.35 59.44,9.35 62.59,12.5 68.28,12.5 73.97,6.81 77.32,6.81 78.84,5.28 85.85,5.28 90.73,10.16 XIO.33
  Bottom 0.203: v48.46,18.39 49.63,17.22 49.63,15.49 50.29,14.83 50.29,10.82 v50.9,10.26
AREF  (via drill 0.41)
  Top 0.305: BR1.1 27.94,22.76 v27.13,23.57
  Bottom 0.254: v27.13,23.57 24.89,25.81 22.45,25.81 21.03,27.23 18.29,27.23 17.68,27.84 17.68,30.99 18.09,31.39 20.62,31.39 21.34,30.68 22.66,30.68 25.4,33.43 25.4,41.25 23.88,42.77 PWMH.8
AVREF
  Top 0.203: 41.15,12.9 41.05,12.8 C19.2
  Top 0.279: U1.75 41.15,12.9
  Top 0.305: C19.2 38.67,12.74 37.9,13.51 35.05,13.51 33.63,12.09 L3.2
AVREFL  (via drill 0.41)
  Top 0.305: L3.1 28.96,12.09 v28.85,12.19 | v29.16,17.48 29.22,17.44 C34.2 28.6,20.23 BR1.2 JR1.2
  Bottom 0.305: v28.85,12.19 29.16,12.5 v29.16,17.48
BD+
  Top 0.254: J3.P3 4.12,22.25 5.38,22.25 5.89,21.74 Z4.2 5.99,22.03 6.91,22.05 9.86,24.99 11.38,24.99 11.58,25.2 13.88,25.2 R20.2
BD-  (via drill 0.41)
  Top 0.254: J3.P2 5.8,22.89 Z3.2 6.52,23.99 6.53,23.98 7.21,23.98 9.14,25.91 10.36,25.91 v10.57,26.11 | v12.9,24.08 13.41,24.08 13.51,23.98 R19.2
  Bottom 0.254: v10.57,26.11 12.6,24.08 v12.9,24.08
BOOST
  Top 0.406: IC2.1 80.94,15.89 C42.1 79.76,16.05 79.48,15.78 D3.C
CANRX0  (via drill 0.41)
  Top 0.203: v45.72,35.15 46.13,35.56 46.13,36.78 U1.24 | v85.45,11.07 84.84,10.46 75.79,10.46 68.89,17.37 62.89,17.37 60.15,14.63 v59.44,14.63 | v47.24,30.58 47.95,31.29 49.99,31.29 50.49,31.8 52.63,31.8 53.03,32.21 v54.46,32.21
  Bottom 0.203: v85.45,11.07 86.87,11.07 88.9,9.04 ADCH.7 | v54.46,32.21 54.46,30.38 53.95,29.87 53.95,25.7 54.15,25.5 54.15,22.35 57.2,19.3 57.2,18.29 58.52,16.97 58.52,15.54 v59.44,14.63 | v45.72,35.15 45.72,32.11 v47.24,30.58
CANTX0  (via drill 0.41)
  Top 0.203: U1.23 46.63,36.84 46.63,35.36 v46.84,35.15 | v48.36,30.58 49.89,30.58 50.7,31.39 52.83,31.39 53.24,31.8 53.85,31.8 54.15,31.5 55.17,31.5 v55.47,31.8 | v59.44,15.65 60.05,16.26 61.06,16.26 62.59,17.78 69.09,17.78 76,10.87 84.12,10.87 85.24,11.99 v86.26,11.99
  Bottom 0.203: v46.84,35.15 46.84,32.11 v48.36,30.58 | v55.47,31.8 55.47,30.79 54.36,29.67 54.36,25.91 54.56,25.7 54.56,22.55 57.61,19.51 57.61,18.49 58.93,17.17 58.93,16.05 v59.44,15.65 | v86.26,11.99 87.07,11.99 89.61,9.35 89.61,6.3 91.44,4.47 ADCH.8
CANTX1/IO  (via drill 0.41)  (2 unrouted)
  Top 0.203: U1.140 60.52,32.78 v62.28,34.54 | v61.67,42.37 62.18,42.37 63.5,41.05 65.63,41.05 65.84,40.84 75.59,40.84 76.2,41.45 79.86,41.45 80.26,41.86 82.3,41.86 82.8,42.37 83.92,42.37 84.84,41.45 v86.87,41.45 | v91.24,8.94 95.3,8.94 XIO.34
  Bottom 0.203: v91.24,8.94 91.24,18.69 90.22,19.71 89.31,20.52 89.31,32.92 86.87,35.36 v86.87,41.45 | v62.28,34.54 62.28,35.05 61.57,35.76 61.57,37.39 62.18,38 62.18,40.23 61.67,40.74 v61.67,42.37
CMP  (via drill 0.41)
  Top 0.203: 17.07,28.91 IC1.5 | 24.18,26.62 Q2.3
  Top 0.305: 17.07,28.91 18.24,28.91 v18.49,29.16 17.92,29.73 C31.2 | 24.74,26.62 24.03,26.62 RN4.4 RN4.3
  Top 0.406: v22.96,26.62 24.03,26.62 24.18,26.62
  Bottom 0.305: v22.96,26.62 22.48,26.62 19.91,29.18 19.51,29.16 v18.49,29.16
D+
  Top 0.254: 37.3,34.8 37.95,34.8 U1.37 | 37.3,34.8 arc-45 37.28,34.81 | 7.92,37.39 8.53,37.39 arc-90 8.99,36.87 arc90 9.19,36.37 9.2,36.37 arc90 9.65,36.58 arc-90 10.11,37.03 arc-90 10.41,36.58 10.41,36.32 arc90 10.67,35.97 arc90 11.12,36.42 arc-90 11.53,36.78 arc-90 11.84,36.27 arc90 12.04,35.66 arc90 12.6,36.02 arc-67 13.27,36 15.81,33.46 arc45 16.22,33.27 20.46,33.27 arc45 20.91,33.46 21.02,33.57 arc-45 21.47,33.76 27.3,33.76 arc45 27.75,33.94 28.87,35.07 arc-45 29.17,35.2 29.95,35.1 arc45 30.23,35.26 arc-45 30.56,35.46 30.79,35.46 arc-90 31.19,35.15 arc90 31.5,34.95 31.8,34.95 arc90 32.11,35.26 arc-90 32.51,35.56 34.63,35.46 | 37.3,34.8 arc-45 37.28,34.81 | 34.39,35.46 R6.1 34.63,35.46 | 37.28,34.81 37.03,34.92 36,34.92 arc22 35.91,34.91 35.71,34.83 arc-10 35.64,34.82 35.49,34.85 arc-45 35.3,35.14 35.21,35.27 arc45 34.79,35.46 34.63,35.46 | 37.28,34.81 37.29,34.8
  Top 0.305: 4.37,38.1 USB1.3 5.49,38.1 7.21,37.39 7.92,37.39 Z1.1
D-
  Top 0.254: 7.92,39.01 8.39,39.01 arc-46 8.8,38.62 8.97,38.33 arc46 10.3,37.69 arc-45 13.96,36.33 15.78,34.51 arc45 16.73,33.98 20.05,33.98 arc45 20.67,34.23 arc-45 21.12,34.47 26.98,34.47 arc45 27.32,34.59 28.55,35.81 arc-45 28.99,35.98 29.6,35.98 arc38 29.99,36.11 30.09,36.19 arc-38 30.48,36.3 35.11,36.3 arc-54 35.6,36.06 arc54 36.15,35.83 36.94,35.83 | 7.72,39.01 Z2.1 | U1.38 38.88,34.28 arc45 39.06,34.33 39.28,34.6 arc45 39.32,34.77 39.32,34.87 arc45 39.07,35.35 38.84,35.59 arc45 38.25,35.81 36.98,35.81 R5.1 | USB1.2 4.45,38.75 arc45 4.47,38.76 | R5.1 36.94,35.83 | 36.94,35.83 36.98,35.76 R5.1
  Top 0.305: 4.22,38.76 4.47,38.76 6.04,38.76 7.21,39.01 7.92,39.01 Z2.1 7.91,39.01
DAC0(CANRX1)  (via drill 0.41)
  Top 0.203: v46.02,11.28 45.52,11.28 44.6,12.19 42.67,12.19 41.66,13.21 41.66,15.04 U1.76 | v46.94,8.43 48.06,8.43 48.56,8.94 50.8,8.94 51.21,8.53 59.84,8.53 62.99,11.68 67.87,11.68 73.56,5.99 76.61,5.99 78.13,4.47 80.06,4.47 80.26,4.27 82.09,4.27 ADCH.5 83.72,2.64
  Bottom 0.203: v46.02,11.28 46.74,10.57 46.74,8.64 v46.94,8.43
DAC1  (via drill 0.41)
  Top 0.203: U1.77 42.15,13.33 42.88,12.6 45.41,12.6 v45.72,12.29 | v46.02,9.14 48.06,9.14 48.26,9.35 51.1,9.35 51.51,8.94 59.64,8.94 62.79,12.09 68.07,12.09 73.76,6.4 77.01,6.4 78.54,4.88 84.02,4.88 ADCH.6
  Bottom 0.203: v45.72,12.29 45.31,11.89 45.31,9.86 v46.02,9.14
DTR
  Top 0.254: R18.1 18.44,16.3 IC6.13
EN
  Top 0.406: IC2.4 83.28,12.6 84.33,12.6 84.88,13.15 85.14,13.15 R10.2
ERASE_CMD  (via drill 0.41)
  Top 0.203: T3.3 29.74,16.56 29.06,16.56 28.14,17.48 v28.14,17.88
  Top 0.254: IC6.23 21.88,20.76 22.25,21.13 23.27,21.13 23.57,21.44 23.57,22.35 v23.67,22.45
  Bottom 0.254: v23.67,22.45 23.67,18.9 24.69,17.88 24.69,16.87 25.6,15.95 26.82,15.95 28.14,17.27 v28.14,17.88
ERASE_S  (via drill 0.41)
  Top 0.203: v42.57,18.09 42.37,17.88 41.05,17.88 39.83,16.66 34.95,16.66 34.44,16.15 31.6,16.15 31.29,15.85 31.29,15.14 31.8,14.63 31.8,13.41 31.39,13.01 29.57,13.01 28.88,13.69 T3.1 | v45.62,27.03 45.92,26.72 47.24,26.72 47.95,27.43 54.36,27.43 54.66,27.13 57.81,27.13 58.47,27.79 U1.130 60.5,27.79 60.86,28.14 60.86,31.19 60.66,31.39 60.66,32.31 61.98,33.63 62.99,33.63 63.09,33.73 63.09,36.27 63.3,36.47 63.3,37.49 65.33,39.52 70,39.52 70.51,39.01 ERASE.2
  Bottom 0.203: v42.57,18.09 42.67,18.09 42.88,17.88 43.89,17.88 44.09,18.09 44.09,18.8 45.41,20.12 45.41,23.06 45.21,23.27 45.21,26.62 v45.62,27.03
FB
  Top 0.61: R12.2 79.43,11.89 R11.1 80.29,11.91 IC2.3
GATE_CMD
  Top 0.203: 17.07,27.61 IC1.7
  Top 0.254: 17.07,27.61 16.43,27.61 16.15,27.33 13.61,27.33 13.41,27.13 13.41,26.42 T1.3
GND  (via drill 0.41, 0.51, 0.61)  (150 unrouted)
  Top 0.203: 41.66,36.98 U1.33 | 10.36,51.61 RESET.2 | 39.23,30.29 39.42,30.48 | U1.126 59.74,25.79 59.74,25.78 | 56.9,16.76 57.1,16.97 v57.3,16.97 | R2.1 20.05,42.61 19.61,42.16 19.61,39.93 19.61,39.94 RN1.2
  Top 0.254: IC6.28 18.44,19.51 | C36.2 14.22,20.26 IC6.3 17.54,20.26 17.68,20.12 17.68,20.02 IC6.33 | 56.65,14.58 56.65,13.97 56.79,13.82 | v57.3,16.97 56.64,16.31 56.64,14.58 56.65,14.58 | 56.65,15.19 56.65,14.58 | 65.19,51.65 IC10.3 65.39,51.04 65.53,50.9 65.94,50.9 66.04,50.8 66.04,49.38 65.6,48.93 C37.2 | 4.57,35.76 4.57,35.78 USB1.S2
  Top 0.279: 39.22,26.62 38.98,26.29 U1.54 37.05,26.29 36.98,26.21 | 39.73,24.08 39.52,24.29 U1.58 | U1.33 41.65,38.2 41.64,38.71 | 41.76,38.91 41.64,38.71 | 41.64,38.71 41.64,34.95 | 39.62,31.29 U1.44 36.79,31.29 36.78,31.29 | 52.02,38.81 52.15,38.69 U1.12 52.15,35.99 52.02,35.87 | U1.74 40.65,15.13 | C8.1 60.8,26.25 60.76,26.21 60.76,25.78 59.74,25.78 59.54,25.78 | U1.46 39.23,30.29 | 56.9,16.76 56.79,16.76 56.64,16.61 | U1.106 56.65,15.19 | 39.78,24.08 39.83,24.03 41.25,24.03
  Top 0.305: 39.73,24.08 39.78,24.08 | C31.1 20.09,30.5 v20.22,30.48 | IC1.4 21.37,29.39 v21.74,29.77 22.85,30.88 RN4.2 | RN4.1 23.35,31.68 23.16,31.5 23.16,30.99 23.27,30.89 RN4.2 | RN4.2 RN4.7 25.81,30.88 26.01,30.68 27.13,30.68 v27.94,31.5 28.41,31.03 C24.2 | RN4.5 25.32,29.28 25.3,29.26 25.3,28.25 v25.09,28.04 26.28,28.04 Q2.2 | C23.2 28.41,28.51 v28.96,29.06 | Y1.2 36.54,39.94 Y1.4 | C22.2 33.69,41.9 33.43,42.16 33.43,43.64 DEBUG.1 | C25.2 28.19,37.13 v27.43,36.37 | IC6.28 18.44,24.2 C30.1 | C38.2 20.46,25.64 v20.52,25.5 | 40.65,15.13 40.65,14.23 40.23,13.82 38.81,13.82 v38.41,14.22 | C28.2 1.73,33.77
  Top 0.356: v34.95,24.18 34,25.14 C15.1 34,25.77 34.34,26.11 | J3.S3 4.09,26.19 4.06,26.21
  Top 0.406: J3.S1 J3.S5 J3.S6 J3.S2 2.36,18.92 3.15,19.71 4.06,19.71 J3.S4 | J3.S4 Z4.1 6.1,19.41 v6.1,18.19 | v82.09,11.79 82.09,13.11 81.69,13.51 IC2.2 79.63,13.51 R11.2 | J3.P5 J3.S4 | C8.1 61.57,27.03 v62.08,27.53 | R18.2 v14.22,12.09 | C34.1 30.38,19.61 v31.09,20.32 | C10.1 38.14,14.49 v38.41,14.22 | RN2.5 18.49,35.15 | 4.37,35.87 arc90 4.55,36.07 4.55,36.78 | 4.47,40.95 4.88,40.95 4.88,42.47
  Top 0.508: C1.- 38.2,9.88 v38.2,11.38 C18.1 | L.C ON.C 8.98,27.37 v7.62,26.01 | 38.34,14.29 v38.41,14.22
  Top 0.61: 4.57,41.66 4.47,41.66 4.47,40.95
  Top 0.813: C27.- 17.68,46.84 v18.8,47.75 | IC4.1 78.26,34.24 78.23,34.14 78.23,34.04 v76.45,34.04 v74.47,34.04 73.46,34.04 73.28,34.22 73.07,34.22 73.05,34.75 C29.- 72.82,35.33 72.95,35.26 v74.47,35.26 | v84.53,17.07 84.56,16.99 D4.P$2 84.68,18.47 C41.- v86.67,20.32 | 13.64,46.81 11.91,46.81 v11.89,46.84 | 4.57,41.66 4.57,40.41 3.15,40.41 | 4.57,34.44 4.57,35.76 | 4.57,35.87 4.57,35.76 | 4.57,35.76 3.15,35.79 4.27,35.79 arc90 4.37,35.87
  Top 1.016: D1.A 20.51,7.94 v20.52,7.92 | PC1.- 22.19,7.99 v22.15,7.92 v25.6,7.92 | C27.- C35.- 13.64,46.81 | USB1.S2 arc90 4.57,35.77 | USB1.S1 arc-90 4.57,40.43 4.57,40.41 | 4.57,40.41 4.57,40.34 4.67,40.34 arc-90 4.57,40.41
  Route2 0.813: 4.27,8.33 7.21,8.33 | 8.64,1.83 8.64,4.78
  other vias: 63.2,39.42 49.99,34.04 68.58,38.61 2.24,4.88 2.24,10.97 10.16,10.97 4.57,33.63 7.82,44.4 99.16,11.61 99.16,19.18 99.16,26.92 99.16,34.44 4.98,42.47 33.32,32.72 71.22,2.44 43.59,50.8 57.3,34.04 67.67,23.57 69.34,36.98 6.1,4.88 30.89,32 6.15,51.16 42.88,32.51 41.27,24.28 11.28,4.88 7.82,19.81 9.55,13.92 7.92,42.06 30.78,22.25 16.76,20.93 31.7,26.52 85.45,20.32 87.78,20.32 62.89,23.88 78.94,17.17 70.51,18.49 69.8,52.12 62.23,49.58 80.92,24.28
  pour Top (isolate 0.305, rank 2): 101.83,53.42 101.63,0.03 -0.05,0.03 -0.05,51.7 arc-90 1.64,53.31
  pour Bottom (isolate 0.406, rank 2): 1.64,53.42 102.06,53.42 102.06,0 -0.3,-0.03 -0.41,51.27 arc-90
  pour Route2 (isolate 0.305, rank 2): 101.73,53.42 101.52,0.03 -0.15,0.03 0.1,35.46 0,39.22 -0.15,51.7 arc-90 1.53,53.31
JTAG_RESET
  Top 0.203: RN1.4 21.15,41.53 21.64,41.05 JTAG.10 | JTAG.10 22.55,41.05 22.55,41.07 | R1.1 22.55,42.47 22.55,41.07 | 22.55,41.07 JTAG.10
JTAG_TCK  (via drill 0.41)
  Top 0.203: RN2.7 18.59,36.73 19.81,36.73 v20.32,37.24 | U1.28 44.15,35.41 v43.89,35.15 | v44.4,46.13 44.09,45.82 37.29,45.82 36.47,46.63 v30.68,46.63 30.38,46.33 21.84,46.33 20.93,45.41 v20.32,45.41
  Bottom 0.203: JTAG.4 v20.32,37.24 v20.32,45.41 | v43.89,35.15 44.09,35.36 44.09,38.71 44.4,39.01 v44.4,46.13
  Bottom 0.254: DEBUG.2 30.68,43.84 v30.68,46.63
JTAG_TDI  (via drill 0.41)
  Top 0.203: v22.15,48.56 v42.98,48.56 | U1.29 43.64,37.67 43.69,37.72 v43.69,39.32
  Top 0.254: RN1.3 20.94,40.73 21.74,39.93 22.38,39.93 JTAG.8
  Bottom 0.203: v43.69,39.32 43.38,39.62 43.38,46.02 43.69,46.33 43.69,47.85 v42.98,48.56 | v22.15,48.56 22.15,46.02 21.54,45.41 21.54,40.03 21.74,39.83 22.55,39.83 22.53,39.8 JTAG.8
JTAG_TDO  (via drill 0.41)
  Top 0.203: v42.98,46.74 42.47,46.23 38.1,46.23 36.98,47.35 29.36,47.35 28.75,46.74 v21.03,46.74 | U1.30 43.13,36.8 43.13,36.58 43.18,36.58 v43.18,34.34
  Bottom 0.203: v21.03,46.74 21.03,39.14 21.67,38.51 JTAG.6 | v42.98,46.74 42.98,38.96 43.18,38.76 v43.18,34.34
JTAG_TMS  (via drill 0.41)
  Top 0.203: v19.51,35.92 18.59,35.92 RN2.6 | v42.47,38.41 42.65,38.23 42.65,37.01 U1.31 | v41.96,46.94 41.66,46.63 38.41,46.63 37.29,47.75 28.45,47.75 v28.14,47.45 20.93,47.45 20.83,47.55 v20.32,47.55
  Bottom 0.203: v41.96,46.94 41.96,38.91 v42.47,38.41 | v20.32,47.55 19.51,46.74 19.51,43.48 19.81,43.18 19.81,41.05 19.51,40.74 v19.51,35.92 22.5,35.92 JTAG.2 | JTAG.2 22.55,35.97 22.55,35.94 JTAG.2 | DEBUG.3 28.14,43.84 v28.14,47.45
L13
  Top 0.203: 21.34,26.98 IC1.1 | RN3.6 14.79,30.54 14.94,30.48 16.05,30.48 16.87,31.29 20.42,31.29 20.93,30.79 20.93,29.97 20.32,29.36 20.32,27.8 20.5,27.61
  Top 0.305: 21.34,26.98 20.32,26.98 20.32,27.43 20.5,27.61 IC1.2
MASTER-RESET  (via drill 0.41)
  Top 0.203: 9.14,46.53 RESET.4 10.46,46.56 10.46,47.65 10.77,47.95 17.58,47.95 18.9,49.28 v30.28,49.28 | v40.34,30.58 39.54,29.79 U1.47 | SPI.5 63.6,25.4 | v62.18,5.89 59.44,5.89 59.03,6.3 57.1,6.3 56.08,7.32 51,7.32 50.7,7.01 49.38,7.01 48.87,7.52 48.16,7.52 46.43,5.79 45.06,5.79 44.86,5.99 38.51,5.99 v38.3,5.79 | v25.5,19 23.88,19 23.61,19.26 23.61,19.47 23.41,19.67 R23.2 | R1.2 25.41,43.73 | v30.68,17.37 31.6,18.29 v34.04,18.29
  Top 0.254: v31.09,41.45 30.68,41.86 25.91,41.86 25.65,42.11 DEBUG.4 25.41,43.73
  Top 0.305: 2.54,46.52 3.96,46.52 3.96,46.53 9.14,46.53 10.06,46.53 | 2.54,46.52 RESET.3 | RESET.4 10.42,46.63 10.06,46.63 10.06,46.53 | 10.06,46.53 10.46,46.53 | C20.1 2.68,46.38 2.54,46.52
  Bottom 0.203: v30.28,49.28 31.9,47.55 36.98,47.55 38.61,45.92 38.61,44.7 39.62,43.59 39.62,37.8 40.54,36.88 40.54,34.14 40.64,34.04 40.64,30.89 v40.34,30.58 | SPI.5 63.6,25.4 64.36,24.64 64.36,24.43 66.34,22.45 66.34,14.33 62.28,10.26 62.28,8.13 62.18,8.03 v62.18,5.89 | POWER.3 33.02,4.67 34.14,5.79 | 34.14,5.79 v38.3,5.79 | 34.14,5.79 34.14,10.46 34.04,10.57 v34.04,18.29 34.04,19.71 32.61,21.13 32.61,24.59 30.28,26.92 30.28,31.5 29.26,32.51 29.26,39.62 v31.09,41.45 | v25.5,19 28.75,19 30.38,17.37 v30.68,17.37
  Bottom 0.254: 31.9,47.55 31.9,44.7 32,44.6 32,42.37 v31.09,41.45
MISO  (via drill 0.41)
  Top 0.203: U1.108 57.71,16.15 58.32,16.76 60.96,16.76 62.48,18.29 68.89,18.29 v69.09,18.49
  Bottom 0.203: 63.6,30.48 SPI.1 64.01,30.48 65.23,29.26 67.87,29.26 69.19,27.94 69.19,27.23 69.49,26.92 69.49,25.91 70.1,25.3 70.1,21.13 69.09,20.12 v69.09,18.49
MISO2  (via drill 0.41)
  Top 0.203: IC6.17 20.64,16.96 v20.73,16.87
  Bottom 0.203: v20.73,16.87 20.22,16.87 19.71,16.36 19.71,15.34 20.02,15.04 21.34,15.04 22.86,13.51 24.64,13.51 ICSP1.1
MOSI  (via drill 0.41)
  Top 0.203: v70.31,20.22 69.6,19.51 63.8,19.51 63.5,19.2 62.69,19.2 60.76,17.27 59.74,17.27 U1.109 | 66.14,27.94 SPI.4 66.17,27.96 66.14,27.94
  Top 0.305: 66.14,27.94 67.26,27.94 67.67,27.53 v70,27.53
  Bottom 0.203: v70,27.53 70,26.21 70.71,25.5 70.71,20.62 v70.31,20.22
MOSI2  (via drill 0.41)
  Top 0.254: IC6.16 19.94,16.54 v20.73,15.75
  Bottom 0.203: v20.73,15.75 22.1,15.75 22.15,15.75 23.16,14.73 ICSP1.4
N$1
  Top 0.203: IC6.26 19.44,22.48 19.81,22.86 20.12,22.86 20.42,23.16 20.56,23.16 R21.1
N$2
  Top 0.254: L.A 12.56,30.54 RN3.3
N$3
  Top 0.254: RN3.4 13.22,29.31 ON.A
N$4
  Top 0.254: 3.21,16.91 3.25,16.87 RX1.A 2.03,15.68 R15.2
N$5
  Top 0.203: U1.51 35.76,27.79 R8.2
N$6  (via drill 0.41)
  Top 0.203: 25.4,31.7 RN4.8
  Top 0.279: 27.13,25.4 26.82,25.4 26.42,25.81 26.42,25.8 Q2.1
  Top 0.305: v26.42,31.5 26.21,31.7 25.4,31.7 | 27.13,25.4 R3.2 28.65,25.4
  Top 0.356: R3.2 28.41,26.15 v27.84,26.72
  Bottom 0.203: v27.84,26.72 26.72,27.84 26.72,31.19 v26.42,31.5
N$7
  Top 0.203: R4.1 31.9,25.4 31.9,25.7 32.41,26.21 33.68,26.21 34.19,26.72 34.21,26.72 34.31,26.82 38,26.82 U1.53
N$10  (1 unrouted)
N$11
  Top 0.203: U1.43 39.3,31.79 40.34,32.82 40.34,35.31 38.96,36.68 36.74,36.68 | 36.73,36.68 36.74,36.68 | 36.74,36.68 36.73,36.68 | 36.73,36.68 36.74,36.68 | 36.74,36.68 R5.2 | 36.73,36.68 36.74,36.68 | 36.74,36.68 36.73,36.68 | 36.73,36.68 36.74,36.68 | 36.74,36.68 36.73,36.68 | 36.73,36.68 36.74,36.68
N$12
  Top 0.203: U1.42 38,32.31 36.58,32.31 35.97,31.7 33.22,31.7 32.51,32.41 32.51,33.83 33.24,34.56 R6.2
N$13  (1 unrouted)
N$14
  Top 0.254: R14.2 3.35,13.45 TX1.A
N$15  (1 unrouted)
N$16  (1 unrouted)
N$17  (1 unrouted)
N$18  (1 unrouted)
N$19  (1 unrouted)
N$20  (1 unrouted)
N$21  (1 unrouted)
N$22  (1 unrouted)
N$27  (1 unrouted)
N$28  (1 unrouted)
N$29  (1 unrouted)
N$30  (1 unrouted)
N$31  (1 unrouted)
N$32  (1 unrouted)
N$33  (1 unrouted)
N$54
  Top 0.254: RN3.1 11.97,33.36 RX.A
N$55
  Top 0.254: RN3.2 11.89,31.34 arc90 TX.A
PIN22  (via drill 0.41)  (2 unrouted)
  Top 0.203: v60.25,37.39 60.05,37.19 57.61,37.19 U1.1 | v66.04,46.23 66.34,45.92 68.07,45.92 68.28,45.72 73.15,45.72 73.76,46.33 77.42,46.33 77.83,46.74 79.86,46.74 80.37,47.24 91.75,47.24 92.76,48.26 XIO.3
  Bottom 0.203: v60.25,37.39 60.76,37.39 61.77,38.41 61.77,40.03 60.86,40.95 60.86,46.33 61.06,46.53 65.73,46.53 v66.04,46.23
PIN23  (via drill 0.41)  (2 unrouted)
  Top 0.203: v59.64,39.42 58.42,39.42 58.12,39.12 55.8,39.12 54.66,37.97 54.66,36.98 U1.7 | v69.6,47.35 70.81,46.13 72.95,46.13 73.56,46.74 77.22,46.74 77.62,47.14 79.65,47.14 80.16,47.65 91.34,47.65 93.27,49.58 95.2,49.58 XIO.4
  Bottom 0.203: v59.64,39.42 59.64,46.94 60.45,47.75 69.19,47.75 v69.6,47.35
PIN24  (via drill 0.41)  (2 unrouted)
  Top 0.203: XIO.5 92.46,45.72 91.34,44.6 87.17,44.6 86.56,45.21 81.38,45.21 80.87,44.7 78.84,44.7 78.44,44.3 74.78,44.3 74.17,43.69 67.26,43.69 67.06,43.89 64.92,43.89 63.3,45.52 60.15,45.52 59.33,44.7 54.56,44.7 v54.25,44.4 | U1.8 54.15,37.89 54.25,38 v54.25,38.91
  Bottom 0.203: v54.25,44.4 v54.25,38.91
PIN25  (via drill 0.41)  (2 unrouted)
  Top 0.203: v51.36,38.2 51.64,37.92 51.64,36.96 U1.13 | v51.51,46.63 51.82,46.33 58.52,46.33 59.33,47.14 64.11,47.14 65.73,45.52 67.87,45.52 68.07,45.31 73.36,45.31 73.97,45.92 77.62,45.92 78.03,46.33 80.06,46.33 80.57,46.84 92.15,46.84 92.25,46.94 95.3,46.94 XIO.6
  Bottom 0.203: v51.51,46.63 52.73,45.52 52.73,39.83 51.71,38.81 51.71,38.56 v51.36,38.2
PIN26  (via drill 0.41)  (2 unrouted)
  Top 0.203: XIO.7 92.56,43.18 91.75,43.79 86.77,43.79 86.16,44.4 81.79,44.4 81.28,43.89 79.25,43.89 78.84,43.48 75.18,43.48 74.57,42.88 66.85,42.88 66.65,43.08 64.52,43.08 62.89,44.7 60.55,44.7 59.74,43.89 55.37,43.89 54.76,43.28 53.65,43.28 52.93,43.99 v52.02,43.99 | U1.14 51.15,35.91 v50.39,35.15
  Bottom 0.203: v52.02,43.99 52.02,39.9 50.6,38.48 50.6,35.36 v50.39,35.15
PIN27  (via drill 0.41)  (2 unrouted)
  Top 0.203: XIO.8 95.2,44.5 92.05,44.5 91.75,44.2 86.97,44.2 86.36,44.81 81.58,44.81 81.08,44.3 79.05,44.3 78.64,43.89 74.98,43.89 74.37,43.28 67.06,43.28 66.85,43.48 64.72,43.48 63.09,45.11 60.35,45.11 59.54,44.3 55.17,44.3 54.56,43.69 53.85,43.69 52.83,44.7 51.31,44.7 v51,44.4 | v50.49,39.42 50.49,38.99 50.65,38.84 U1.15 50.65,36.83
  Bottom 0.203: v51,44.4 51,39.93 v50.49,39.42
PIN28  (via drill 0.41)  (4 unrouted)
  Top 0.203: U1.16 50.14,36.78 50.14,37.85 50.19,37.9 50.19,38.6 50.2,38.7 49.78,39.12 v49.78,40.23 | v49.99,43.18 51,43.18 51.31,42.88 52.83,42.88 53.24,42.47 55.17,42.47 55.78,43.08 60.15,43.08 60.96,43.89 62.48,43.89 64.11,42.27 66.24,42.27 66.45,42.06 74.98,42.06 75.59,42.67 79.25,42.67 79.65,43.08 81.69,43.08 82.19,43.59 85.75,43.59 86.36,42.98 90.93,42.98 92.46,41.66 92.46,41.05 92.86,40.64 XIO.9
  Bottom 0.203: v49.78,40.23 49.78,42.98 v49.99,43.18
PIN29  (via drill 0.41)
  Top 0.203: XIO.10 95.3,41.86 93.07,41.86 91.34,43.38 86.56,43.38 85.95,43.99 81.99,43.99 81.48,43.48 79.45,43.48 79.05,43.08 75.39,43.08 74.78,42.47 66.65,42.47 66.45,42.67 64.31,42.67 62.69,44.3 60.76,44.3 59.94,43.48 55.58,43.48 54.97,42.88 53.44,42.88 53.03,43.28 51.61,43.28 51.21,43.69 50.6,43.69 50.09,44.2 48.16,44.2 47.55,44.81 47.55,45.21 v47.14,45.62 | U1.19 48.65,37.88 48.77,38 48.77,38.91 48.16,39.52 v46.74,39.52
  Bottom 0.203: v46.74,39.52 46.74,45.21 v47.14,45.62
PIN30  (via drill 0.41)
  Top 0.203: 47.14,36.78 U1.22 47.15,36.78 47.14,36.78 | 47.14,36.78 47.14,37.69 46.94,37.9 46.94,38.2 v46.63,38.51 | v47.65,47.85 47.85,47.85 49.78,45.92 58.73,45.92 59.54,46.74 63.91,46.74 65.53,45.11 67.67,45.11 67.87,44.91 73.56,44.91 74.17,45.52 77.83,45.52 78.23,45.92 80.26,45.92 80.77,46.43 89.2,46.43 v89.61,46.02
  Bottom 0.203: XIO.11 91.49,38.1 89.61,39.98 v89.61,46.02 | v46.63,38.51 46.02,39.12 46.02,44.81 46.33,45.11 46.33,45.92 47.65,47.24 v47.65,47.85
PIN31  (via drill 0.41)
  Top 0.203: v45.21,38.2 45.14,38.12 45.14,37.11 U1.26 | v45.82,47.14 47.95,47.14 49.58,45.52 58.93,45.52 59.74,46.33 63.7,46.33 65.33,44.7 67.46,44.7 67.67,44.5 73.76,44.5 74.37,45.11 78.03,45.11 78.44,45.52 80.47,45.52 80.97,46.02 87.99,46.02 v88.7,45.31 | v89,39.42 95.2,39.42 XIO.12
  Bottom 0.203: v45.82,47.14 45.82,46.74 45.52,46.43 45.52,45.52 45.21,45.21 v45.21,38.2 | v89,39.42 89,42.57 88.7,42.88 v88.7,45.31
PIN32  (via drill 0.41)
  Top 0.203: U1.32 42.15,35.48 v42.47,35.15 | v87.58,36.17 88.19,35.56 XIO.13 94.08,35.56 | v44.4,47.14 45.11,46.43 46.23,46.43 46.53,46.74 47.75,46.74 49.38,45.11 59.13,45.11 59.94,45.92 63.5,45.92 65.13,44.3 67.26,44.3 67.46,44.09 73.97,44.09 74.57,44.7 78.23,44.7 78.64,45.11 80.67,45.11 81.18,45.62 87.27,45.62 v87.58,45.31
  Bottom 0.203: v42.47,35.15 42.47,37.39 41.25,38.61 41.25,47.75 42.16,48.67 42.16,48.97 42.47,49.28 43.48,49.28 44.4,48.46 v44.4,47.14 | v87.58,45.31 v87.58,36.17
PIN33  (via drill 0.41)
  Top 0.203: v56.69,28.35 56.39,28.04 54.97,28.04 54.76,28.25 46.63,28.25 46.13,27.74 40.84,27.74 40.54,27.43 40.23,27.43 39.73,26.92 39.73,26.31 39.22,25.81 38.2,25.81 U1.55 | v88.29,42.27 87.99,42.57 86.16,42.57 85.55,43.18 82.4,43.18 81.89,42.67 79.86,42.67 79.45,42.27 75.79,42.27 75.18,41.66 66.24,41.66 66.04,41.86 63.91,41.86 62.28,43.48 61.16,43.48 60.35,42.67 57.71,42.67 v57.4,42.37 | v88.29,37.8 89.31,36.78 95.3,36.78 XIO.14
  Bottom 0.203: v88.29,37.8 v88.29,42.27 | v56.69,28.35 57.1,28.75 58.62,28.75 60.05,30.18 60.05,34.04 57.51,36.58 57.51,39.83 58.12,40.44 58.12,41.66 v57.4,42.37
PIN34  (via drill 0.41)
  Top 0.203: v56.79,24.18 55.88,23.27 53.7,23.27 53.39,23.57 49.28,23.57 49.17,23.47 40.95,23.47 40.84,23.57 39.42,23.57 39.22,23.77 38.2,23.77 U1.59 | XIO.15 92.96,33.02 90.73,30.79 90.22,30.79 87.99,28.55 74.37,28.55 73.36,29.57 69.8,29.57 69.6,29.36 v68.89,29.36
  Bottom 0.203: v68.89,29.36 66.34,31.9 62.99,31.9 62.18,31.09 62.18,29.87 58.52,26.21 57.51,26.21 56.79,25.5 v56.79,24.18
PIN35  (via drill 0.41)